# EAGLE schematic AdaptadorAcceso (EAGLE 9.6.2)
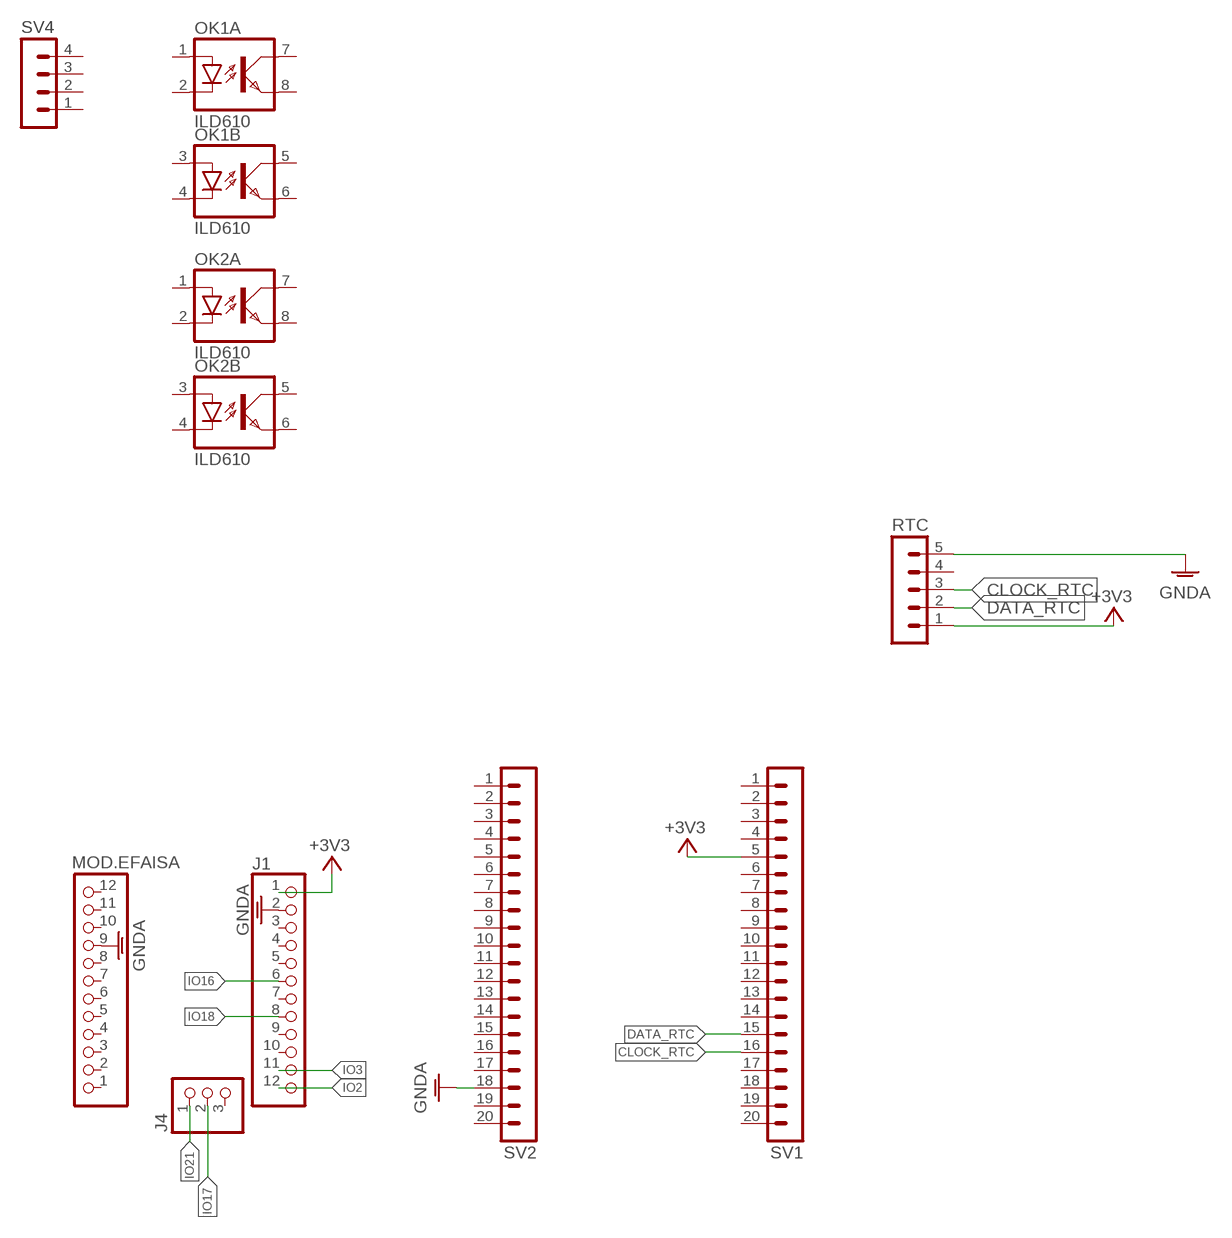
[diagram p0: schematic, sheet 1]

## Parts
J1  PINHD-1X12  [1X12]
J4  PINHD-1X3  [1X03]
MOD.EFAISA  PINHD-1X12  [1X12]
OK1  ILD610  [DIL08]
OK2  ILD610  [DIL08]
RTC  MA05-1  [MA05-1]
SV1  MA20-1L  [MA20-1L]
SV2  MA20-1L  [MA20-1L]
SV4  MA04-1  [MA04-1]

## Nets
+3V3 [normal]: J1.1 RTC.1 SV1.5
CLOCK_RTC: RTC.3 SV1.16
DATA_RTC: RTC.2 SV1.15
GNDA [normal]: J1.2 MOD.EFAISA.9 RTC.5 SV2.18
IO2: J1.12
IO3: J1.11
IO16: J1.6
IO17: J4.2
IO18: J1.8
IO21: J4.1
Unconnected: J1.3 J1.4 J1.5 J1.7 J1.9 J1.10 J4.3 MOD.EFAISA.1 MOD.EFAISA.2 MOD.EFAISA.3 MOD.EFAISA.4 MOD.EFAISA.5 MOD.EFAISA.6 MOD.EFAISA.7 MOD.EFAISA.8 MOD.EFAISA.10 MOD.EFAISA.11 MOD.EFAISA.12 OK1.1(A:A) OK1.2(A:C) OK1.3(B:A) OK1.4(B:C) OK1.5(B:COL) OK1.6(B:EMIT) OK1.7(A:COL) OK1.8(A:EMIT) OK2.1(A:A) OK2.2(A:C) OK2.3(B:A) OK2.4(B:C) OK2.5(B:COL) OK2.6(B:EMIT) OK2.7(A:COL) OK2.8(A:EMIT) RTC.4 SV1.1 SV1.2 SV1.3 SV1.4 SV1.6 SV1.7 SV1.8 SV1.9 SV1.10 SV1.11 SV1.12 SV1.13 SV1.14 SV1.17 SV1.18 SV1.19 SV1.20 SV2.1 SV2.2 SV2.3 SV2.4 SV2.5 SV2.6 SV2.7 SV2.8 SV2.9 SV2.10 SV2.11 SV2.12 SV2.13 SV2.14 SV2.15 SV2.16 SV2.17 SV2.19 SV2.20 SV4.1 SV4.2 SV4.3 SV4.4

## Library data of the parts
J1 MOD.EFAISA = pinhead:PINHD-1X12: PIN HEADER
J4 = pinhead:PINHD-1X3: PIN HEADER
OK1 OK2 = optocoupler:ILD610: SIEMENS OPTO COUPLER; MF: VISHAY/TELEFUNKEN; MPN: ILD610-4; OC_FARNELL: unknown; OC_NEWARK: 20H8702
RTC = con-lstb:MA05-1: PIN HEADER; OC_FARNELL: unknown; OC_NEWARK: unknown
SV1 SV2 = con-lstb:MA20-1L: PIN HEADER; OC_FARNELL: unknown; OC_NEWARK: unknown
SV4 = con-lstb:MA04-1: PIN HEADER; OC_FARNELL: unknown; OC_NEWARK: unknown

## Net classes
0 gruesa: width 0.9 mm, drill 0.508 mm, clearance 0.559 mm
1 normal: width 0.8 mm, drill 0.508 mm, clearance 0.559 mm
2 fina: width 0.5 mm, drill 0.508 mm, clearance 0.381 mm
3 Ultra Fina: width 0.4 mm, drill 0.508 mm, clearance 0.254 mm